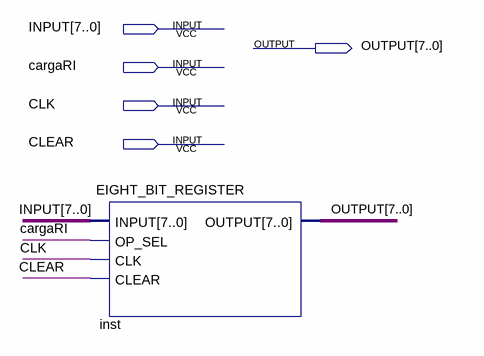
[diagram p0: schematic sheet]
// Quartus schematic RI.bdf as structural Verilog: 1 symbols, 5 pins
module RI (
  input  [7:0] INPUT,
  input  cargaRI,
  input  CLK,
  input  CLEAR,
  output [7:0] OUTPUT
);

  EIGHT_BIT_REGISTER inst (.INPUT(INPUT), .OP_SEL(cargaRI), .CLK(CLK), .CLEAR(CLEAR), .OUTPUT(OUTPUT));
endmodule
